# Altium project FLYING_DIVING.PrjPCB
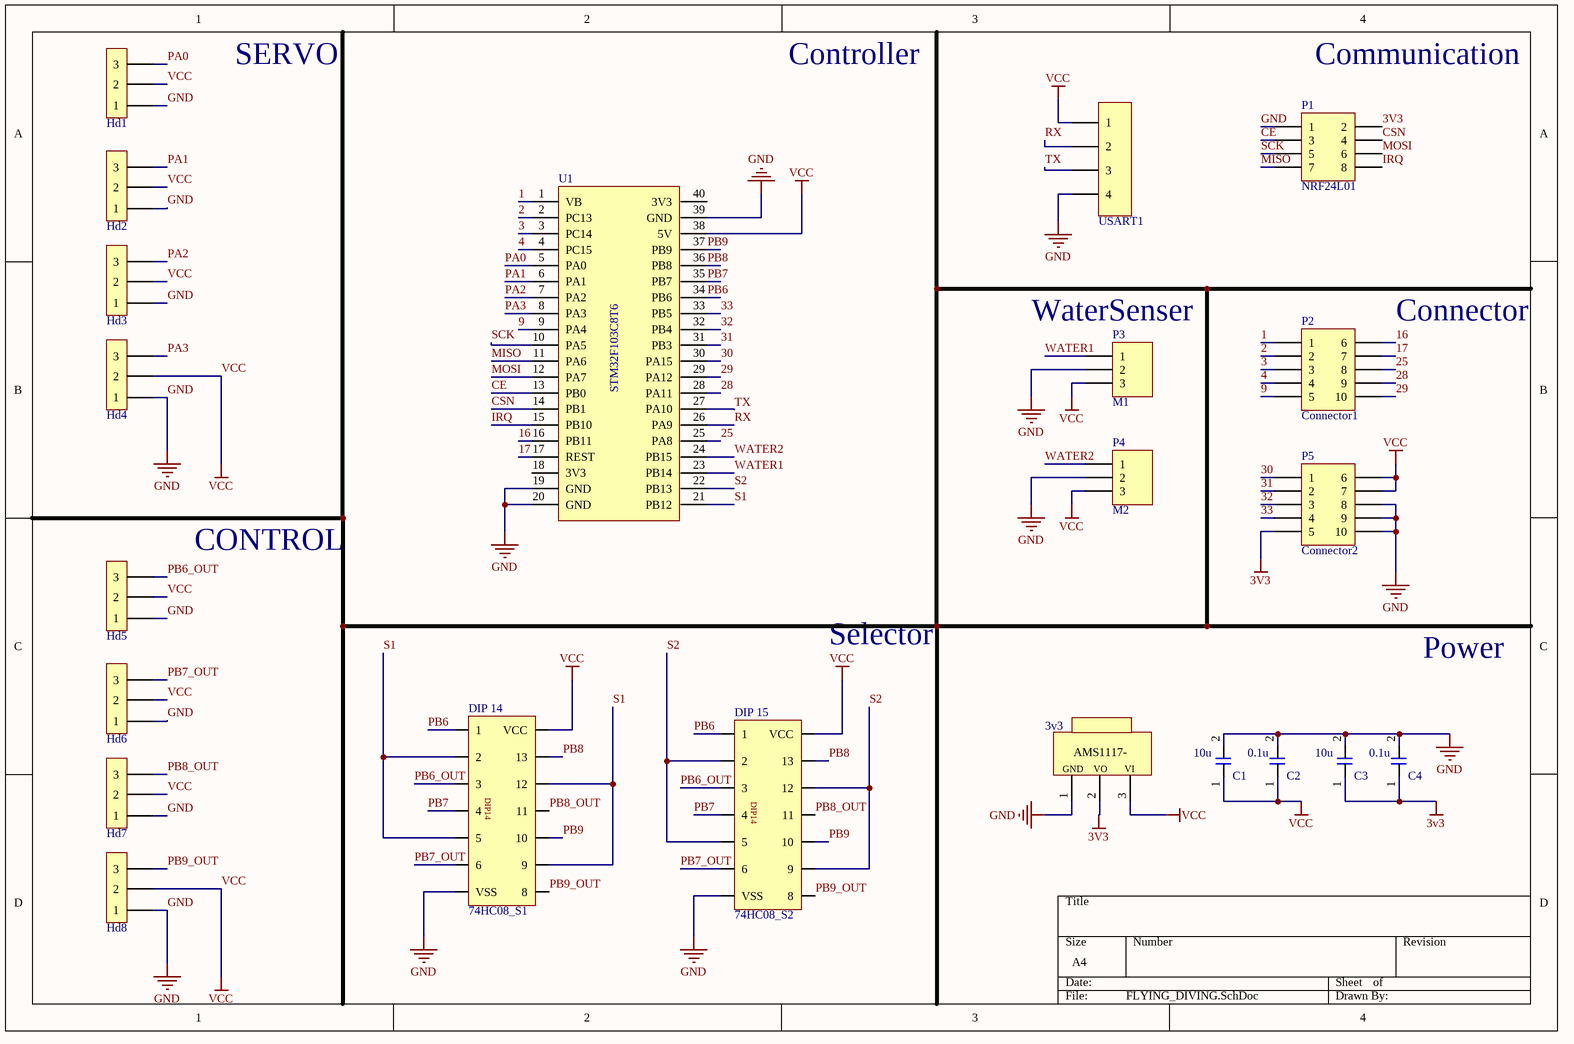
[diagram p0: FLYING_DIVING.SchDoc]
1 sheet, 22 parts. Net scope: global (net labels, ports and power ports of the same name join across sheets).
Board file: FLYING_DIVING.PcbDoc

## Sheet FLYING_DIVING.SchDoc
size A4

### Parts
3v3  AMS1117-  [AMS1117-]  (value not drawn)
C1  10u  [0805电容]
C2  0.1u  [0805电容]
C3  10u  [0805电容]
C4  0.1u  [0805电容]
DIP_14  74HC08_S1  [DIP 14]
DIP_15  74HC08_S2  [DIP 14]
Hd1  Header3  [Header3]  (value not drawn)
Hd2  Header3  [Header3]  (value not drawn)
Hd3  Header3  [Header3]  (value not drawn)
Hd4  Header3  [Header3]  (value not drawn)
Hd5  Header3  [Header3]  (value not drawn)
Hd6  Header3  [Header3]  (value not drawn)
Hd7  Header3  [Header3]  (value not drawn)
Hd8  Header3  [Header3]  (value not drawn)
P1  NRF24L01  [HDR2X4]
P2  Connector1  [HDR2X5_CEN]
P3  M1  [HDR1X3]
P4  M2  [HDR1X3]
P5  Connector2  [HDR2X5_CEN]
U1  STM32F103C8T6  [DIP40]  (value not drawn)
USART1  Header4  [Header4]  (value not drawn)

### Nets
3V3: 3v3.2(Vout) C3.1 C4.1 P1.2 P5.5
GND: 3v3.1(GND) C1.2 C2.2 C3.2 C4.2 DIP_14.7(VSS) DIP_15.7(VSS) Hd1.1 Hd2.1 Hd3.1 Hd4.1 Hd5.1 Hd6.1 Hd7.1 Hd8.1 P1.1 P3.2 P4.2 P5.8 P5.9 P5.10 U1.19(GND) U1.20(GND) U1.39(GND) USART1.4
VCC: 3v3.3(Vin) C1.1 C2.1 DIP_14.14(VCC) DIP_15.14(VCC) Hd1.2 Hd2.2 Hd3.2 Hd4.2 Hd5.2 Hd6.2 Hd7.2 Hd8.2 P3.3 P4.3 P5.6 P5.7 U1.38(5V) USART1.1
1: P2.1 U1.1(VB)
2: P2.2 U1.2(PC13)
3: P2.3 U1.3(PC14)
4: P2.4 U1.4(PC15)
9: P2.5 U1.9(PA4)
16: P2.6 U1.16(PB11)
17: P2.7 U1.17(REST)
25: P2.8 U1.25(PA8)
28: P2.9 U1.28(PA11)
29: P2.10 U1.29(PA12)
30: P5.1 U1.30(PA15)
31: P5.2 U1.31(PB3)
32: P5.3 U1.32(PB4)
33: P5.4 U1.33(PB5)
CE: P1.3 U1.13(PB0)
CSN: P1.4 U1.14(PB1)
IRQ: P1.8 U1.15(PB10)
MISO: P1.7 U1.11(PA6)
MOSI: P1.6 U1.12(PA7)
PA0: Hd1.3 U1.5(PA0)
PA1: Hd2.3 U1.6(PA1)
PA2: Hd3.3 U1.7(PA2)
PA3: Hd4.3 U1.8(PA3)
PB6: DIP_14.1 DIP_15.1 U1.34(PB6)
PB6_OUT: DIP_14.3 DIP_15.3 Hd5.3
PB7: DIP_14.4 DIP_15.4 U1.35(PB7)
PB7_OUT: DIP_14.6 DIP_15.6 Hd6.3
PB8: DIP_14.13 DIP_15.13 U1.36(PB8)
PB8_OUT: DIP_14.11 DIP_15.11 Hd7.3
PB9: DIP_14.10 DIP_15.10 U1.37(PB9)
PB9_OUT: DIP_14.8 DIP_15.8 Hd8.3
RX: U1.26(PA9) USART1.2
S1: DIP_14.2 DIP_14.5 DIP_14.9 DIP_14.12 U1.21(PB12)
S2: DIP_15.2 DIP_15.5 DIP_15.9 DIP_15.12 U1.22(PB13)
SCK: P1.5 U1.10(PA5)
TX: U1.27(PA10) USART1.3
WATER1: P3.1 U1.23(PB14)
WATER2: P4.1 U1.24(PB15)

Not connected (* = marked no-connect by the designer): U1 18(3V3) 40(3V3)

### Notes on the sheet
- SERVO
- Controller
- Communication
- (near P3) WaterSenser
- (near P2) Connector
- CONTROL
- Selector
- Power
- (in symbol AMS1117-) VO; VI
- (in symbol DIP 14) DIP14

### Library data of the parts
C1-C4 = 0805电容
DIP_14 DIP_15 = DIP 14
P1 = Header 4X2: Header, 4-Pin, Dual row; LatestRevisionDate: 17-Jul-2002; LatestRevisionNote: Re-released for DXP Platform.; Publisher: Altium Limited
P2 P5 = Header 5X2A: Header, 5-Pin, Dual row; LatestRevisionDate: 17-Jul-2002; LatestRevisionNote: Re-released for DXP Platform.; Publisher: Altium Limited
P3 P4 = Header 3: Header, 3-Pin; LatestRevisionDate: 17-Jul-2002; LatestRevisionNote: Re-released for DXP Platform.; Publisher: Altium Limited